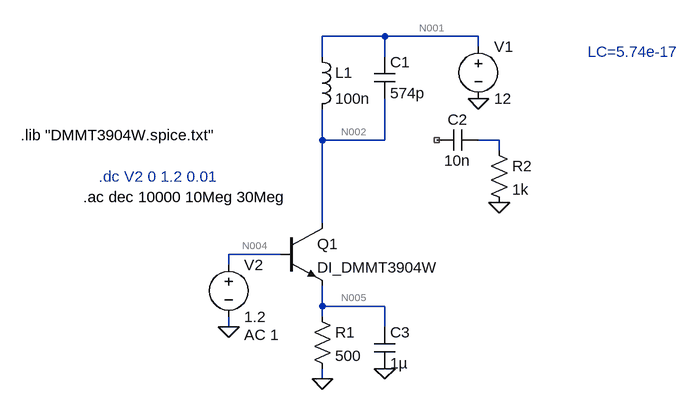
[diagram p0: schematic modelling.asc]
modelling.asc, the LTspice schematic file:
Version 4.1
SHEET 1 880 680
WIRE 288 -192 192 -192
WIRE 432 -192 288 -192
WIRE 432 -176 432 -192
WIRE 192 -160 192 -192
WIRE 288 -160 288 -192
WIRE 192 -32 192 -80
WIRE 288 -32 288 -96
WIRE 288 -32 192 -32
WIRE 464 -32 432 -32
WIRE 464 -16 464 -32
WIRE 192 96 192 -32
WIRE 128 144 48 144
WIRE 48 160 48 144
WIRE 192 224 192 192
WIRE 288 224 192 224
WIRE 192 240 192 224
WIRE 48 256 48 240
WIRE 288 256 288 224
WIRE 192 336 192 320
FLAG 432 -96 0
FLAG 48 256 0
FLAG 192 336 0
FLAG 464 64 0
FLAG 288 320 0
SYMBOL npn 128 96 R0
SYMATTR InstName Q1
SYMATTR Value DI_DMMT3904W
SYMBOL voltage 432 -192 R0
WINDOW 123 0 0 Left 0
WINDOW 39 0 0 Left 0
SYMATTR InstName V1
SYMATTR Value 12
SYMBOL voltage 48 144 R0
WINDOW 123 24 124 Left 2
WINDOW 39 0 0 Left 0
SYMATTR InstName V2
SYMATTR Value 1.2
SYMATTR Value2 AC 1
SYMBOL res 176 224 R0
SYMATTR InstName R1
SYMATTR Value 500
SYMBOL ind 176 -176 R0
SYMATTR InstName L1
SYMATTR Value 100n
SYMATTR SpiceLine Rser=1m
SYMBOL cap 272 -160 R0
SYMATTR InstName C1
SYMATTR Value 574p
SYMBOL cap 432 -48 R90
WINDOW 0 0 32 VBottom 2
WINDOW 3 32 32 VTop 2
SYMATTR InstName C2
SYMATTR Value 10n
SYMBOL res 448 -32 R0
SYMATTR InstName R2
SYMATTR Value 1k
SYMBOL cap 272 256 R0
SYMATTR InstName C3
SYMATTR Value 1µ
TEXT -272 -40 Left 2 !.lib "DMMT3904W.spice.txt"
TEXT -152 24 Left 2 ;.dc V2 0 1.2 0.01
TEXT -176 56 Left 2 !.ac dec 10000 10Meg 30Meg
TEXT 600 -168 Left 2 ;LC=5.74e-17

The netlist it stands for:
* modelling.asc
Q1 N002 N004 N005 0 DI_DMMT3904W
V1 N001 0 12
V2 N004 0 1.2 AC 1
R1 N005 0 500
L1 N001 N002 100n Rser=1m
C1 N001 N002 574p
C2 N003 NC_01 10n
R2 N003 0 1k
C3 N005 0 1µ
.model NPN NPN
.model PNP PNP
.lib standard.bjt
.lib "DMMT3904W.spice.txt"
* .dc V2 0 1.2 0.01
.ac dec 10000 10Meg 30Meg
* LC=5.74e-17
.backanno
.end

* Results of the author's LTspice run, read from the files saved beside the schematic
* Operating Point, zero values left out:
*   V(n001) = 12 V
*   V(n002) = 12 V
*   V(n004) = 1.2 V
*   V(n005) = 560.6 mV
*   I(L1) = 1.116 mA
*   I(R1) = 1.121 mA
*   I(V1) = -1.116 mA
*   I(V2) = -5.53 µA
*   Ib(Q1) = 5.53 µA
*   Ic(Q1) = 1.116 mA
*   Ie(Q1) = -1.121 mA
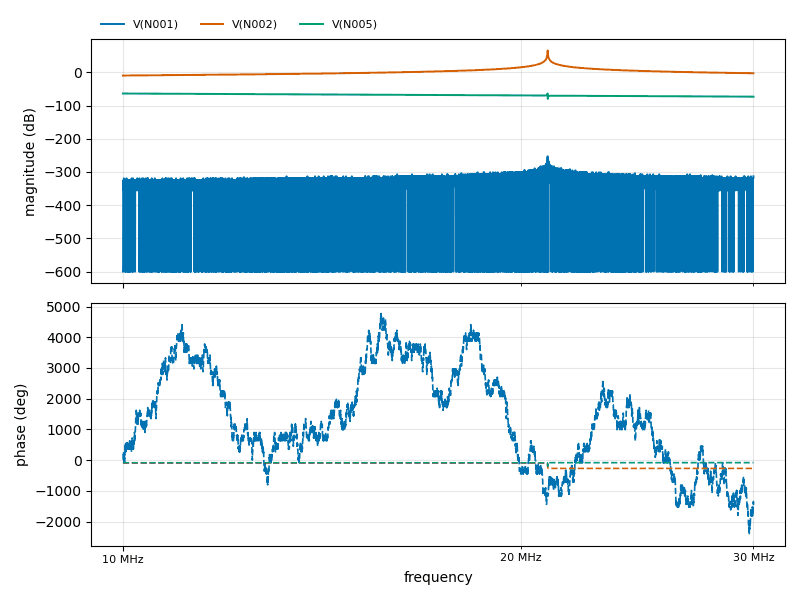
[diagram p1: AC Analysis of modelling.asc, plotted from the saved traces]
* AC Analysis, 1 run:
*   V(N001): -600.00 dB at 10 MHz, -313.07 dB at 30 MHz, peak -252.87 dB at 20.96 MHz, 3 dB below the peak at 20.95 MHz and 20.96 MHz
*   V(N002): -9.59 dB at 10 MHz, -2.70 dB at 30 MHz, peak 65.84 dB at 20.96 MHz, 3 dB below the peak at 20.95 MHz and 20.96 MHz
*   V(N005): -63.71 dB at 10 MHz, -73.19 dB at 30 MHz, peak -63.66 dB at 20.96 MHz, 3 dB below the peak at 20.95 MHz and 20.96 MHz